# Altium project FIT_TCM.PrjPcb (part 2 of 9)

## Sheet FIT_TCM_Main_PLL.SchDoc: FIT_PM12 board
size 420 x 297 mm; CheckedBy: G.Kasprowicz; Author: INR Moscow; CompanyName: WUT ISE; DrawnBy: M.Podgórski; Organization: WUT ISE; Address1: PW ISE; Address2: Nowowiejska 15/19 00-665 Warsaw; Address3: gkasprow@gmail.com; Revision: 2; SheetNumber: -; SheetTotal: -; ModifiedBy: -; CheckedDate: -; Title2: Title 2; DivGrp: WUT ISE; Designer: INR RAS; ModifiedDate: -; ProjectName: Sensor Box
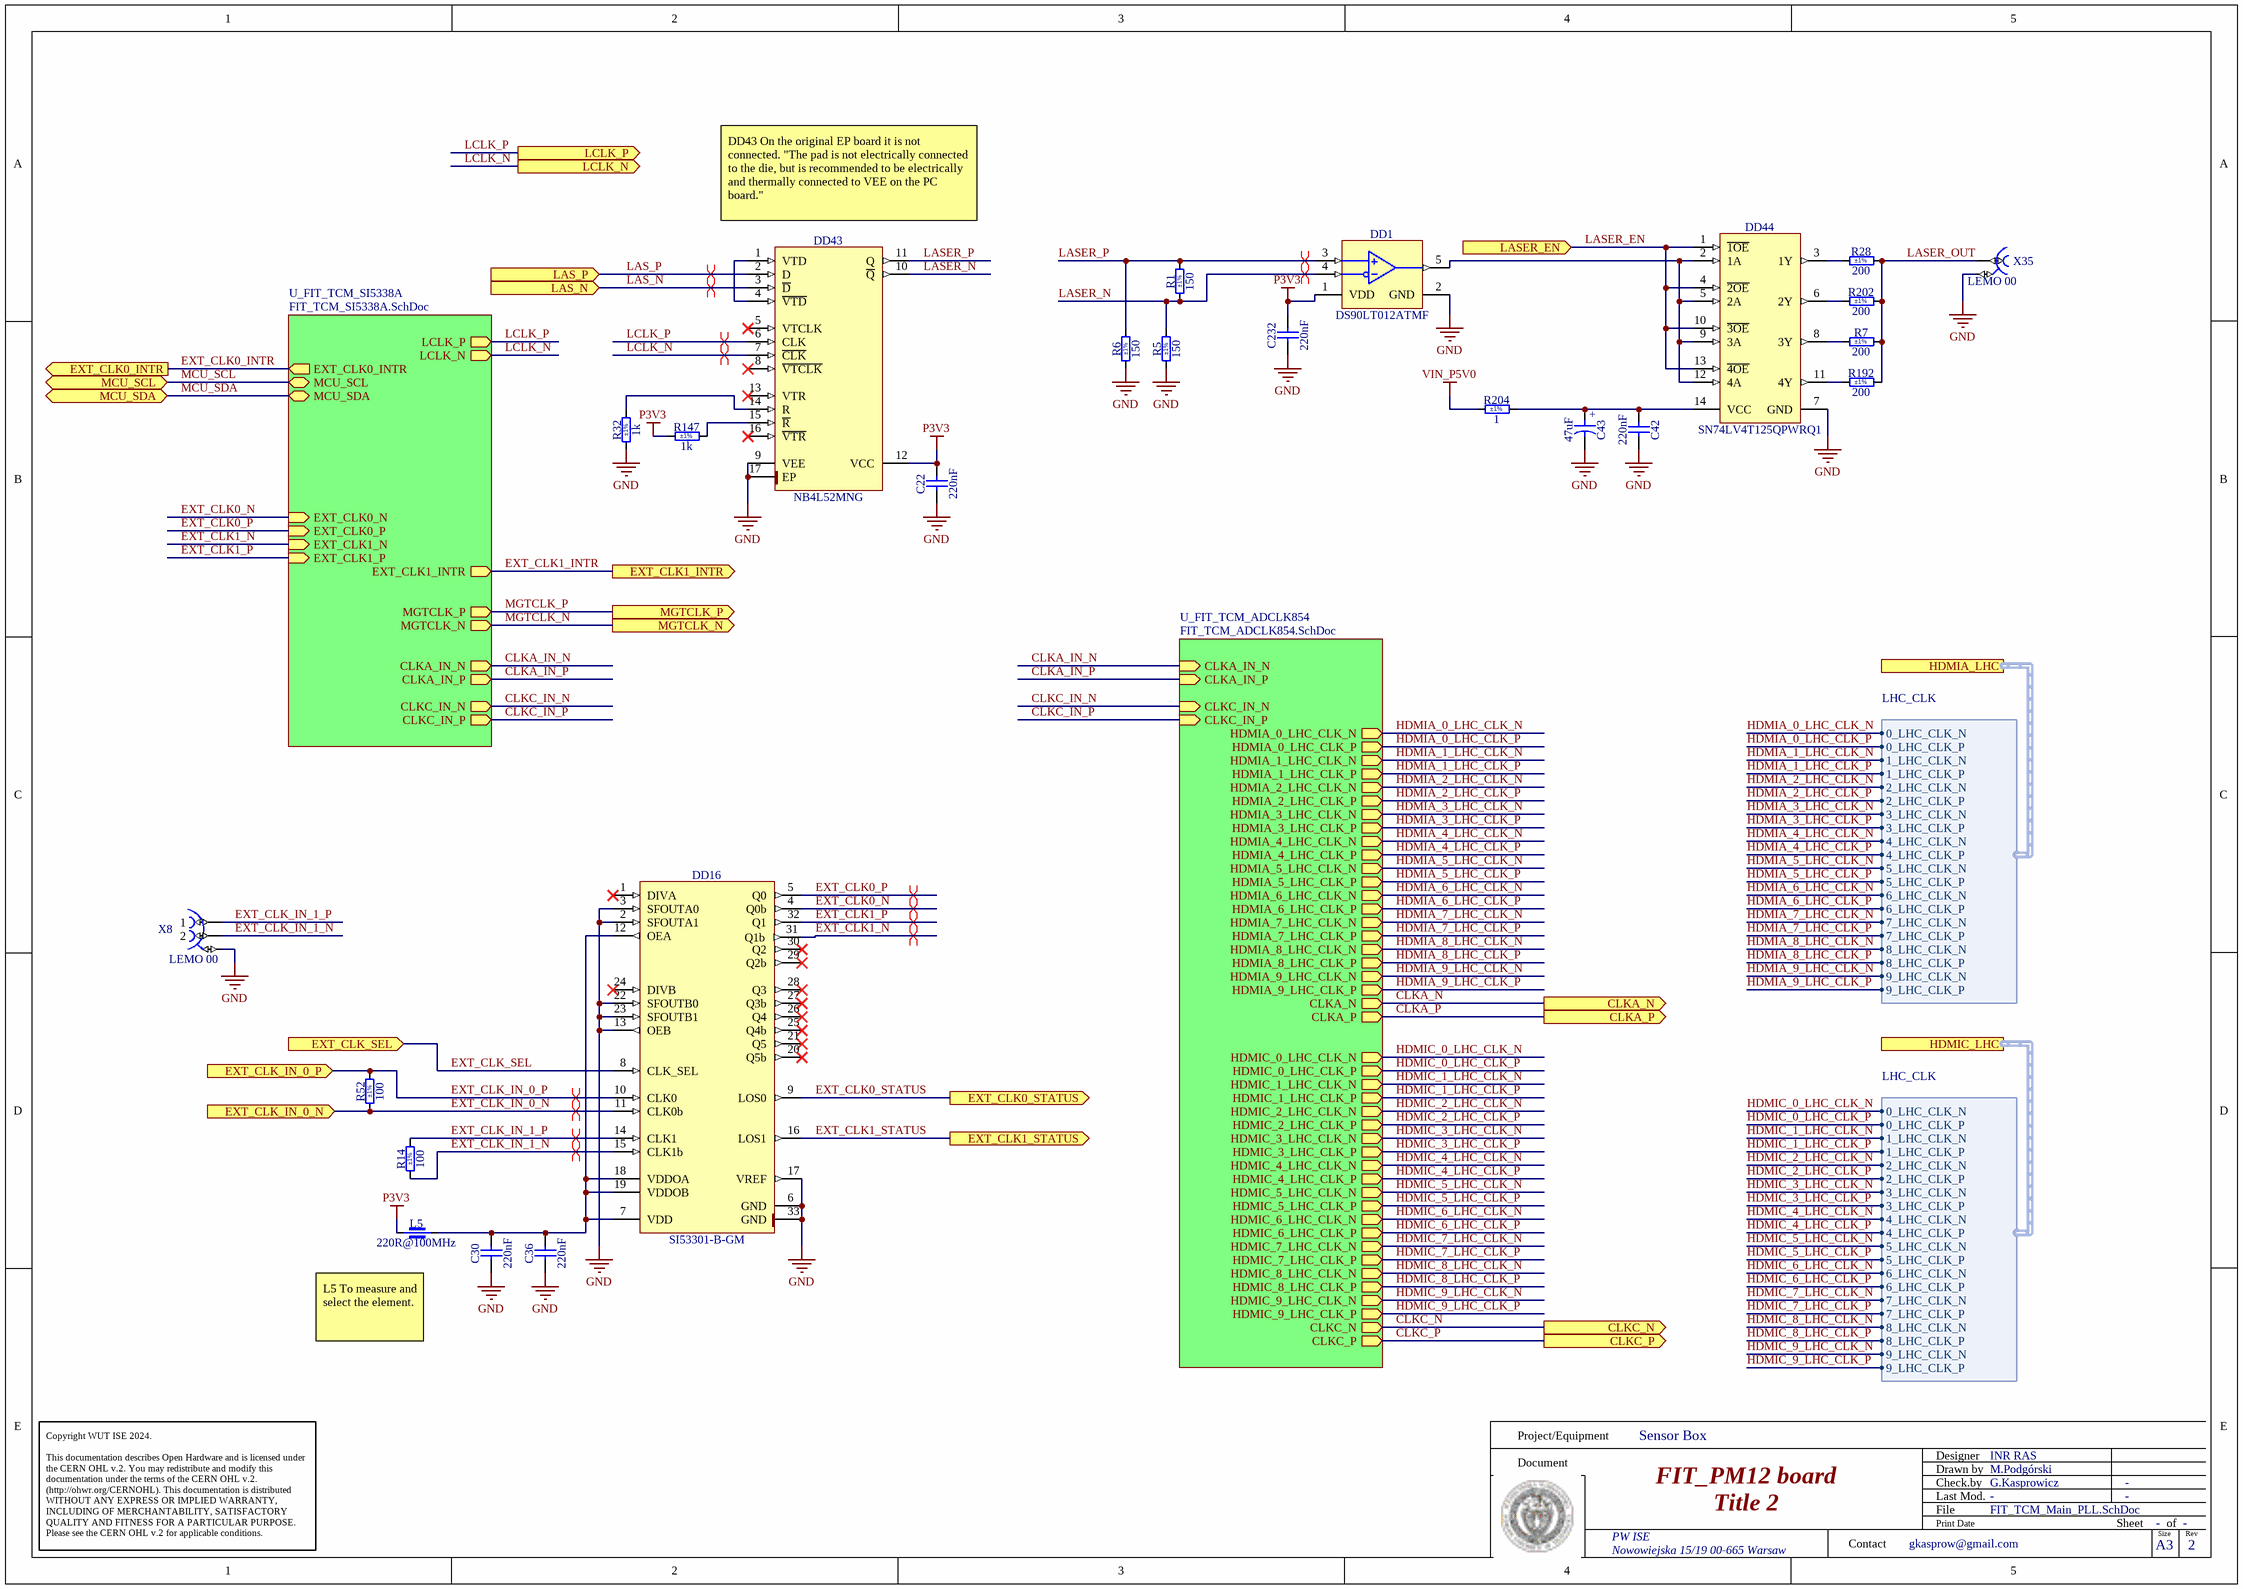
[diagram p2: FIT_TCM_Main_PLL.SchDoc]

### Parts
C22  220nF  [CAPC2012X135N]
C30  220nF  [CAPC2012X135N]
C36  220nF  [CAPC2012X135N]
C42  220nF  [CAPC2012X135N]
C43  47uF  [CAPAE530X610N]
C232  220nF  [CAPC2012X135N]
DD1  DS90LT012ATMF  [SOT95P280X145-5N]
DD16  SI53301-B-GM  [QFN50P500X500X100-33N-S230]
DD43  NB4L52MNG  [QFN50P300X300X100-17N-S185]
DD44  SN74LV4T125QPWRQ1  [SOP65P640X120-14N]
L5  220R@100MHz  [INDC2012X105N]
R1  150  Tolerance: ±1%  [RESC2012X60N]
R5  150  Tolerance: ±1%  [RESC2012X60N]
R6  150  Tolerance: ±1%  [RESC2012X60N]
R7  200  Tolerance: ±1%  [RESC2012X60N]
R14  100  Tolerance: ±1%  [RESC1608X55N]
R28  200  Tolerance: ±1%  [RESC2012X60N]
R32  1k  Tolerance: ±1%  [RESC2012X60N]
R52  100  Tolerance: ±1%  [RESC1608X55N]
R147  1k  Tolerance: ±1%  [RESC2012X60N]
R192  200  Tolerance: ±1%  [RESC2012X60N]
R202  200  Tolerance: ±1%  [RESC2012X60N]
R204  1  Tolerance: ±1%  [RESC2012X60N]
X8  LEMO 00  [LEMO_EPG.00.302.NLN]
X35  LEMO 00  [LEMO_EPL.00.250.NTN]

### Sub-sheets
U_FIT_TCM_ADCLK854 = FIT_TCM_ADCLK854.SchDoc: HDMIA_0_LHC_CLK_P (out), HDMIA_0_LHC_CLK_N (out), HDMIA_1_LHC_CLK_P (out), HDMIA_1_LHC_CLK_N (out), HDMIA_2_LHC_CLK_P (out), HDMIA_2_LHC_CLK_N (out), HDMIA_3_LHC_CLK_P (out), HDMIA_3_LHC_CLK_N (out), HDMIA_4_LHC_CLK_P (out), HDMIA_4_LHC_CLK_N (out), HDMIA_5_LHC_CLK_P (out), HDMIA_5_LHC_CLK_N (out), HDMIA_6_LHC_CLK_P (out), HDMIA_6_LHC_CLK_N (out), HDMIA_7_LHC_CLK_P (out), HDMIA_7_LHC_CLK_N (out), HDMIA_8_LHC_CLK_P (out), HDMIA_8_LHC_CLK_N (out), HDMIA_9_LHC_CLK_P (out), HDMIA_9_LHC_CLK_N (out), CLKA_P (out), CLKA_N (out), CLKA_IN_P (in), CLKA_IN_N (in), HDMIC_0_LHC_CLK_P (out), HDMIC_0_LHC_CLK_N (out), HDMIC_1_LHC_CLK_P (out), HDMIC_1_LHC_CLK_N (out), HDMIC_2_LHC_CLK_P (out), HDMIC_2_LHC_CLK_N (out), HDMIC_3_LHC_CLK_P (out), HDMIC_3_LHC_CLK_N (out), HDMIC_4_LHC_CLK_P (out), HDMIC_4_LHC_CLK_N (out), HDMIC_5_LHC_CLK_P (out), HDMIC_5_LHC_CLK_N (out), HDMIC_6_LHC_CLK_P (out), HDMIC_6_LHC_CLK_N (out), HDMIC_7_LHC_CLK_P (out), HDMIC_7_LHC_CLK_N (out), HDMIC_8_LHC_CLK_P (out), HDMIC_8_LHC_CLK_N (out), HDMIC_9_LHC_CLK_P (out), HDMIC_9_LHC_CLK_N (out), CLKC_P (out), CLKC_N (out), CLKC_IN_P (in), CLKC_IN_N (in)
U_FIT_TCM_SI5338A = FIT_TCM_SI5338A.SchDoc: EXT_CLK0_P (in), EXT_CLK0_N (in), EXT_CLK1_P (in), EXT_CLK1_N (in), MCU_SDA (bidir), MCU_SCL (bidir), EXT_CLK0_INTR (out), EXT_CLK1_INTR (out), LCLK_P (out), LCLK_N (out), CLKA_IN_P (out), CLKA_IN_N (out), CLKC_IN_P (out), CLKC_IN_N (out), MGTCLK_P (out), MGTCLK_N (out)

### Ports
CLKA_N (out), CLKA_P (out), CLKC_N (out), CLKC_P (out), EXT_CLK0_INTR (out), EXT_CLK0_STATUS (out), EXT_CLK1_INTR (out), EXT_CLK1_STATUS (out), EXT_CLK_IN_0_N (in), EXT_CLK_IN_0_P (in), EXT_CLK_SEL (in), HDMIA_LHC (harness LHC_CLK), HDMIC_LHC (harness LHC_CLK), LAS_N (in), LAS_P (in), LASER_EN (in), LCLK_N (out), LCLK_P (out), MCU_SCL (bidir), MCU_SDA (bidir), MGTCLK_N (out), MGTCLK_P (out)

### Harnesses
LHC_CLK: 0_LHC_CLK_N, 0_LHC_CLK_P, 1_LHC_CLK_N, 1_LHC_CLK_P, 2_LHC_CLK_N, 2_LHC_CLK_P, 3_LHC_CLK_N, 4_LHC_CLK_N, 3_LHC_CLK_P, 4_LHC_CLK_P, 5_LHC_CLK_N, 5_LHC_CLK_P, 6_LHC_CLK_N, 6_LHC_CLK_P, 7_LHC_CLK_N, 7_LHC_CLK_P, 8_LHC_CLK_N, 8_LHC_CLK_P, 9_LHC_CLK_N, 9_LHC_CLK_P

### Nets
GND: C22.1 C30.1 C36.1 C42.2 C43.2 C232.1 DD1.2(GND) DD16.2(SFOUTA1) DD16.3(SFOUTA0) DD16.6(GND) DD16.13(OEB) DD16.17(VREF) DD16.22(SFOUTB0) DD16.23(SFOUTB1) DD16.33(GND) DD43.9(VEE) DD43.17(EP) DD44.7(GND) R5.1 R6.1 R32.1 X8.3 X35.2
P3V3: C22.2 C232.2 DD1.1(VDD) DD43.12(VCC) L5.1 R147.1
VIN_P5V0: R204.1
CLKA_IN_N: sheet U_FIT_TCM_ADCLK854/CLKA_IN_N, sheet U_FIT_TCM_SI5338A/CLKA_IN_N
CLKA_IN_P: sheet U_FIT_TCM_ADCLK854/CLKA_IN_P, sheet U_FIT_TCM_SI5338A/CLKA_IN_P
CLKA_N: port CLKA_N, sheet U_FIT_TCM_ADCLK854/CLKA_N
CLKA_P: port CLKA_P, sheet U_FIT_TCM_ADCLK854/CLKA_P
CLKC_IN_N: sheet U_FIT_TCM_ADCLK854/CLKC_IN_N, sheet U_FIT_TCM_SI5338A/CLKC_IN_N
CLKC_IN_P: sheet U_FIT_TCM_ADCLK854/CLKC_IN_P, sheet U_FIT_TCM_SI5338A/CLKC_IN_P
CLKC_N: port CLKC_N, sheet U_FIT_TCM_ADCLK854/CLKC_N
CLKC_P: port CLKC_P, sheet U_FIT_TCM_ADCLK854/CLKC_P
EXT_CLK0_INTR: port EXT_CLK0_INTR, sheet U_FIT_TCM_SI5338A/EXT_CLK0_INTR
EXT_CLK0_N: DD16.4(Q0b) ; sheet U_FIT_TCM_SI5338A/EXT_CLK0_N
EXT_CLK0_P: DD16.5(Q0) ; sheet U_FIT_TCM_SI5338A/EXT_CLK0_P
EXT_CLK0_STATUS: DD16.9(LOS0) ; port EXT_CLK0_STATUS
EXT_CLK1_INTR: port EXT_CLK1_INTR, sheet U_FIT_TCM_SI5338A/EXT_CLK1_INTR
EXT_CLK1_N: DD16.31(Q1b) ; sheet U_FIT_TCM_SI5338A/EXT_CLK1_N
EXT_CLK1_P: DD16.32(Q1) ; sheet U_FIT_TCM_SI5338A/EXT_CLK1_P
EXT_CLK1_STATUS: DD16.16(LOS1) ; port EXT_CLK1_STATUS
EXT_CLK_IN_0_N: DD16.11(CLK0b) R52.1 ; port EXT_CLK_IN_0_N
EXT_CLK_IN_0_P: DD16.10(CLK0) R52.2 ; port EXT_CLK_IN_0_P
EXT_CLK_IN_1_N: DD16.15(CLK1b) R14.1 X8.2
EXT_CLK_IN_1_P: DD16.14(CLK1) R14.2 X8.1
EXT_CLK_SEL: DD16.8(CLK_SEL) ; port EXT_CLK_SEL
HDMIA_0_LHC_CLK_N: sheet U_FIT_TCM_ADCLK854/HDMIA_0_LHC_CLK_N, port HDMIA_LHC.0_LHC_CLK_N  [project net HDMIA_LHC.0_LHC_CLK_N]
HDMIA_0_LHC_CLK_P: sheet U_FIT_TCM_ADCLK854/HDMIA_0_LHC_CLK_P, port HDMIA_LHC.0_LHC_CLK_P  [project net HDMIA_LHC.0_LHC_CLK_P]
HDMIA_1_LHC_CLK_N: sheet U_FIT_TCM_ADCLK854/HDMIA_1_LHC_CLK_N, port HDMIA_LHC.1_LHC_CLK_N  [project net HDMIA_LHC.1_LHC_CLK_N]
HDMIA_1_LHC_CLK_P: sheet U_FIT_TCM_ADCLK854/HDMIA_1_LHC_CLK_P, port HDMIA_LHC.1_LHC_CLK_P  [project net HDMIA_LHC.1_LHC_CLK_P]
HDMIA_2_LHC_CLK_N: sheet U_FIT_TCM_ADCLK854/HDMIA_2_LHC_CLK_N, port HDMIA_LHC.2_LHC_CLK_N  [project net HDMIA_LHC.2_LHC_CLK_N]
HDMIA_2_LHC_CLK_P: sheet U_FIT_TCM_ADCLK854/HDMIA_2_LHC_CLK_P, port HDMIA_LHC.2_LHC_CLK_P  [project net HDMIA_LHC.2_LHC_CLK_P]
HDMIA_3_LHC_CLK_N: sheet U_FIT_TCM_ADCLK854/HDMIA_3_LHC_CLK_N, port HDMIA_LHC.3_LHC_CLK_N  [project net HDMIA_LHC.3_LHC_CLK_N]
HDMIA_3_LHC_CLK_P: sheet U_FIT_TCM_ADCLK854/HDMIA_3_LHC_CLK_P, port HDMIA_LHC.3_LHC_CLK_P  [project net HDMIA_LHC.3_LHC_CLK_P]
HDMIA_4_LHC_CLK_N: sheet U_FIT_TCM_ADCLK854/HDMIA_4_LHC_CLK_N, port HDMIA_LHC.4_LHC_CLK_N  [project net HDMIA_LHC.4_LHC_CLK_N]
HDMIA_4_LHC_CLK_P: sheet U_FIT_TCM_ADCLK854/HDMIA_4_LHC_CLK_P, port HDMIA_LHC.4_LHC_CLK_P  [project net HDMIA_LHC.4_LHC_CLK_P]
HDMIA_5_LHC_CLK_N: sheet U_FIT_TCM_ADCLK854/HDMIA_5_LHC_CLK_N, port HDMIA_LHC.5_LHC_CLK_N  [project net HDMIA_LHC.5_LHC_CLK_N]
HDMIA_5_LHC_CLK_P: sheet U_FIT_TCM_ADCLK854/HDMIA_5_LHC_CLK_P, port HDMIA_LHC.5_LHC_CLK_P  [project net HDMIA_LHC.5_LHC_CLK_P]
HDMIA_6_LHC_CLK_N: sheet U_FIT_TCM_ADCLK854/HDMIA_6_LHC_CLK_N, port HDMIA_LHC.6_LHC_CLK_N  [project net HDMIA_LHC.6_LHC_CLK_N]
HDMIA_6_LHC_CLK_P: sheet U_FIT_TCM_ADCLK854/HDMIA_6_LHC_CLK_P, port HDMIA_LHC.6_LHC_CLK_P  [project net HDMIA_LHC.6_LHC_CLK_P]
HDMIA_7_LHC_CLK_N: sheet U_FIT_TCM_ADCLK854/HDMIA_7_LHC_CLK_N, port HDMIA_LHC.7_LHC_CLK_N  [project net HDMIA_LHC.7_LHC_CLK_N]
HDMIA_7_LHC_CLK_P: sheet U_FIT_TCM_ADCLK854/HDMIA_7_LHC_CLK_P, port HDMIA_LHC.7_LHC_CLK_P  [project net HDMIA_LHC.7_LHC_CLK_P]
HDMIA_8_LHC_CLK_N: sheet U_FIT_TCM_ADCLK854/HDMIA_8_LHC_CLK_N, port HDMIA_LHC.8_LHC_CLK_N  [project net HDMIA_LHC.8_LHC_CLK_N]
HDMIA_8_LHC_CLK_P: sheet U_FIT_TCM_ADCLK854/HDMIA_8_LHC_CLK_P, port HDMIA_LHC.8_LHC_CLK_P  [project net HDMIA_LHC.8_LHC_CLK_P]
HDMIA_9_LHC_CLK_N: sheet U_FIT_TCM_ADCLK854/HDMIA_9_LHC_CLK_N, port HDMIA_LHC.9_LHC_CLK_N  [project net HDMIA_LHC.9_LHC_CLK_N]
HDMIA_9_LHC_CLK_P: sheet U_FIT_TCM_ADCLK854/HDMIA_9_LHC_CLK_P, port HDMIA_LHC.9_LHC_CLK_P  [project net HDMIA_LHC.9_LHC_CLK_P]
HDMIC_0_LHC_CLK_N: sheet U_FIT_TCM_ADCLK854/HDMIC_0_LHC_CLK_N, port HDMIC_LHC.0_LHC_CLK_N  [project net HDMIC_LHC.0_LHC_CLK_N]
HDMIC_0_LHC_CLK_P: sheet U_FIT_TCM_ADCLK854/HDMIC_0_LHC_CLK_P, port HDMIC_LHC.0_LHC_CLK_P  [project net HDMIC_LHC.0_LHC_CLK_P]
HDMIC_1_LHC_CLK_N: sheet U_FIT_TCM_ADCLK854/HDMIC_1_LHC_CLK_N, port HDMIC_LHC.1_LHC_CLK_N  [project net HDMIC_LHC.1_LHC_CLK_N]
HDMIC_1_LHC_CLK_P: sheet U_FIT_TCM_ADCLK854/HDMIC_1_LHC_CLK_P, port HDMIC_LHC.1_LHC_CLK_P  [project net HDMIC_LHC.1_LHC_CLK_P]
HDMIC_2_LHC_CLK_N: sheet U_FIT_TCM_ADCLK854/HDMIC_2_LHC_CLK_N, port HDMIC_LHC.2_LHC_CLK_N  [project net HDMIC_LHC.2_LHC_CLK_N]
HDMIC_2_LHC_CLK_P: sheet U_FIT_TCM_ADCLK854/HDMIC_2_LHC_CLK_P, port HDMIC_LHC.2_LHC_CLK_P  [project net HDMIC_LHC.2_LHC_CLK_P]
HDMIC_3_LHC_CLK_N: sheet U_FIT_TCM_ADCLK854/HDMIC_3_LHC_CLK_N, port HDMIC_LHC.3_LHC_CLK_N  [project net HDMIC_LHC.3_LHC_CLK_N]
HDMIC_3_LHC_CLK_P: sheet U_FIT_TCM_ADCLK854/HDMIC_3_LHC_CLK_P, port HDMIC_LHC.3_LHC_CLK_P  [project net HDMIC_LHC.3_LHC_CLK_P]
HDMIC_4_LHC_CLK_N: sheet U_FIT_TCM_ADCLK854/HDMIC_4_LHC_CLK_N, port HDMIC_LHC.4_LHC_CLK_N  [project net HDMIC_LHC.4_LHC_CLK_N]
HDMIC_4_LHC_CLK_P: sheet U_FIT_TCM_ADCLK854/HDMIC_4_LHC_CLK_P, port HDMIC_LHC.4_LHC_CLK_P  [project net HDMIC_LHC.4_LHC_CLK_P]
HDMIC_5_LHC_CLK_N: sheet U_FIT_TCM_ADCLK854/HDMIC_5_LHC_CLK_N, port HDMIC_LHC.5_LHC_CLK_N  [project net HDMIC_LHC.5_LHC_CLK_N]
HDMIC_5_LHC_CLK_P: sheet U_FIT_TCM_ADCLK854/HDMIC_5_LHC_CLK_P, port HDMIC_LHC.5_LHC_CLK_P  [project net HDMIC_LHC.5_LHC_CLK_P]
HDMIC_6_LHC_CLK_N: sheet U_FIT_TCM_ADCLK854/HDMIC_6_LHC_CLK_N, port HDMIC_LHC.6_LHC_CLK_N  [project net HDMIC_LHC.6_LHC_CLK_N]
HDMIC_6_LHC_CLK_P: sheet U_FIT_TCM_ADCLK854/HDMIC_6_LHC_CLK_P, port HDMIC_LHC.6_LHC_CLK_P  [project net HDMIC_LHC.6_LHC_CLK_P]
HDMIC_7_LHC_CLK_N: sheet U_FIT_TCM_ADCLK854/HDMIC_7_LHC_CLK_N, port HDMIC_LHC.7_LHC_CLK_N  [project net HDMIC_LHC.7_LHC_CLK_N]
HDMIC_7_LHC_CLK_P: sheet U_FIT_TCM_ADCLK854/HDMIC_7_LHC_CLK_P, port HDMIC_LHC.7_LHC_CLK_P  [project net HDMIC_LHC.7_LHC_CLK_P]
HDMIC_8_LHC_CLK_N: sheet U_FIT_TCM_ADCLK854/HDMIC_8_LHC_CLK_N, port HDMIC_LHC.8_LHC_CLK_N  [project net HDMIC_LHC.8_LHC_CLK_N]
HDMIC_8_LHC_CLK_P: sheet U_FIT_TCM_ADCLK854/HDMIC_8_LHC_CLK_P, port HDMIC_LHC.8_LHC_CLK_P  [project net HDMIC_LHC.8_LHC_CLK_P]
HDMIC_9_LHC_CLK_N: sheet U_FIT_TCM_ADCLK854/HDMIC_9_LHC_CLK_N, port HDMIC_LHC.9_LHC_CLK_N  [project net HDMIC_LHC.9_LHC_CLK_N]
HDMIC_9_LHC_CLK_P: sheet U_FIT_TCM_ADCLK854/HDMIC_9_LHC_CLK_P, port HDMIC_LHC.9_LHC_CLK_P  [project net HDMIC_LHC.9_LHC_CLK_P]
LAS_N: DD43.3(~{D}) ; port LAS_N
LAS_P: DD43.2(D) ; port LAS_P
LASER_EN: DD44.1(~{1OE}) DD44.4(~{2OE}) DD44.10(~{3OE}) DD44.13(~{4OE}) ; port LASER_EN
LASER_N: DD1.4(IN-) DD43.10(~{Q}) R1.1 R5.2
LASER_OUT: R7.2 R28.2 R192.2 R202.2 X35.1
LASER_P: DD1.3(IN+) DD43.11(Q) R1.2 R6.2
LCLK_N: DD43.7(~{CLK}) ; port LCLK_N, sheet U_FIT_TCM_SI5338A/LCLK_N
LCLK_P: DD43.6(CLK) ; port LCLK_P, sheet U_FIT_TCM_SI5338A/LCLK_P
MCU_SCL: port MCU_SCL, sheet U_FIT_TCM_SI5338A/MCU_SCL
MCU_SDA: port MCU_SDA, sheet U_FIT_TCM_SI5338A/MCU_SDA
MGTCLK_N: port MGTCLK_N, sheet U_FIT_TCM_SI5338A/MGTCLK_N
MGTCLK_P: port MGTCLK_P, sheet U_FIT_TCM_SI5338A/MGTCLK_P
NetC30_2: C30.2 C36.2 DD16.7(VDD) DD16.12(OEA) DD16.18(VDDOA) DD16.19(VDDOB) L5.2
NetC42_1: C42.1 C43.1 DD44.14(VCC) R204.2
NetDD1_5: DD1.5(TTLOUT) DD44.2(1A) DD44.5(2A) DD44.9(3A) DD44.12(4A)
NetDD43_1: DD43.1(VTD) DD43.4(~{VTD})
NetDD43_14: DD43.14(R) R32.2
NetDD43_15: DD43.15(~{R}) R147.2
NetDD44_3: DD44.3(1Y) R28.1
NetDD44_6: DD44.6(2Y) R202.1
NetDD44_8: DD44.8(3Y) R7.1
NetDD44_11: DD44.11(4Y) R192.1

Not connected (* = marked no-connect by the designer): DD16 1(DIVA)* 20(Q5b)* 21(Q5)* 24(DIVB)* 25(Q4b)* 26(Q4)* 27(Q3b)* 28(Q3)* 29(Q2b)* 30(Q2)*; DD43 5(VTCLK)* 8(~{VTCLK})* 13(VTR)* 16(~{VTR})*

### Layout directives
differential pair: EXT_CLK0_N, EXT_CLK0_P, EXT_CLK1_N, EXT_CLK1_P, EXT_CLK_IN_0_N, EXT_CLK_IN_0_P, EXT_CLK_IN_1_N, EXT_CLK_IN_1_P, LAS_N, LAS_P, LASER_N, LASER_P, LCLK_N, LCLK_P

### Notes on the sheet
- (near DD43) DD43 On the original EP board it is not connected. "The pad is not electrically connected to the die, but is recommended to be electrically and thermally connected to VEE on the PC board."
- (near L5) L5 To measure and select the element.
- Project/Equipment
- Document
- Designer
- Drawn by
- Check.by
- Copyright WUT ISE 2024.
  This documentation describes Open Hardware and is licensed under the CERN OHL v.2. You may redistribute and modify this documentation under the terms of the CERN OHL v.2. (http://ohwr.org/CERNOHL). This documentation is distributed WITHOUT ANY EXPRESS OR IMPLIED WARRANTY, INCLUDING OF MERCHANTABILITY, SATISFACTORY QUALITY AND FITNESS FOR A PARTICULAR PURPOSE. Please see the CERN OHL v.2 for applicable conditions.
- Contact
- File
- Last Mod.
- Print Date
- Sheet
- Size
- A3
- of
- Rev
- (in symbol CAE530-610_47UF_16V_20%) +

### Library data of the parts
C22 C30 C36 C42 C232 = CC0805_220NF_50V_10%_X7R: as C71 on sheet FIT_TCM_ATxmega; Part Number: CC0805_220NF_50V_10%_X7R; Component Kind: Standard; Component Type: Standard; Pin Count: 2; Value: 220nF; Status: Preferred; Manufacturer Part Number: CC0805_220NF_50V_10%_X7R; Case: 0805; Mounted: Yes; Socket: No; SMD: Yes; Sense: No; Manufacturer1 Example: MURATA; Manufacturer1 ComponentHeight: 1.35mm; HelpURL: \\cern.ch\dfs\Applications\Altium\Datasheets\CC0805_X7R_MURATA.pdf; Author: CERN DEM JLC; CreateDate: 03.12.2007; LatestRevisionDate: 03.12.2007
C43 = CAE530-610_47UF_16V_20%: Polarised capacitor; Part Description: Conductive Polymer Hybrid Aluminum Electrolytic Capacitor; Manufacturer: CHEMI-CON; Manufacturer Part Number: HHXD160ARA470ME61G; Voltage: 16V; Tolerance: ±20%; Part Number: CAE530-610_47UF_16V_20%; Component Kind: Standard; Component Type: Standard; Pin Count: 2; Value: 47uF; Status: Not Recommended; Case: C; Mounted: Yes; Socket: No; SMD: Yes; Sense: No; ComponentHeight: 6.1mm; HelpURL: \\cern.ch\dfs\Applications\Altium\Datasheets\CAE_CHIMI-CON_HXD.pdf; Author: CERN DEM HF; CreateDate: 15.04.2024; LatestRevisionDate: 15.04.2024
DD1 = DS90LT012ATMF: 3V LVDS Single CMOS Differential Line Receiver; Manufacturer: TEXAS INSTRUMENTS; PressFit: No; Bonding: No; Part Number: DS90LT012ATMF; Component Kind: Standard; Component Type: Standard; Device: DS90LT012ATMF; PackageDescription: SOT, 0.95mm Pitch; 5 Pin, 1.60mm W X 2.90mm L X 1.45mm H body, IPC Medium Density; Part Description: 3V LVDS Single CMOS Differential Line Receiver; Manufacturer Part Number: DS90LT012ATMF; Pin Count: 5; Case: SOT23-5; Mounted: Yes; Socket: No; SMD: Yes; Sense: No; ComponentHeight: 1.45mm; Author: CERN DEM HF; HelpURL: \\cern.ch\dfs\Applications\Altium\Datasheets\DS90LT012ATMF.pdf; CreateDate: 08.05.2024; LatestRevisionDate: 08.05.2024
DD16 = SI53301-B-GM: I2C-Programmable Any-Frequency, Any-Output Quad Clock Generator; Part Description: Ultra-Low Additive Jitter Fanout Clock Buffers with up to 10 Universal Outputs from Any-Format Input and Wide Frequency Range from 1 MHz to 725 MHz; Manufacturer: SKYWORKS; PressFit: No; Bonding: No; Part Number: SI53301-B-GM; Component Kind: Standard; Component Type: Standard; Device: SI53301-B-GM; PackageDescription: QFN, 0.50mm Pitch, Square; 32 Pin, 5.00mm L X 5.00mm W X 1mm H body (w/Thermal Tab 2.3 X 2.3mm), IPC Medium Density; Manufacturer Part Number: SI53301-B-GM; Pin Count: 33; Case: QFN32; Mounted: Yes; Socket: No; SMD: Yes; Sense: No; ComponentHeight: 1mm; HelpURL: \\cern.ch\dfs\Applications\Altium\Datasheets\SI53301.pdf; Author: CERN DEM HF; CreateDate: 09.05.2023; LatestRevisionDate: 09.05.2023
DD43 = NB4L52MNG: 2.5 V/3.3 V/5.0 V Differential Data/Clock D Flip-Flop with Reset; Manufacturer: ON SEMICONDUCTOR; PressFit: No; Bonding: No; Part Number: NB4L52MNG; Component Kind: Standard; Component Type: Standard; Device: NB4L52MNG; PackageDescription: QFN, 0.50mm Pitch, Square; 16 Pin, 3.00mm L X 3.00mm W X 1.00mm H body (w/Thermal Tab 1.85 X 1.85mm), IPC Medium Density; Part Description: 2.5 V/3.3 V/5.0 V Differential Data/Clock D Flip-Flop with Reset; Manufacturer Part Number: NB4L52MN; Pin Count: 16; Case: QFN16; Mounted: Yes; Socket: No; SMD: Yes; Sense: No; ComponentHeight: 1mm; Author: CERN DEM MR; HelpURL: \\cern.ch\dfs\Applications\Altium\Datasheets\NB4L52MNG.pdf; CreateDate: 15.01.2016; LatestRevisionDate: 04.04.2022
DD44 = SN74LV4T125QPWRQ1: Quadruple Buffer Translator With 3-State Outputs; Manufacturer: TEXAS INSTRUMENTS; PressFit: No; Bonding: No; Part Number: SN74LV4T125QPWRQ1; Component Kind: Standard; Component Type: Standard; Device: SN74LV4T125QPWRQ1; PackageDescription: SOP, 0.65mm Pitch; 14 Pin, 4.40mm W X 5.00mm L X 1.20mm H body, IPC Medium Density; Part Description: Quadruple Buffer Translator With 3-State Outputs; Manufacturer Part Number: SN74LV4T125QPWRQ1; Pin Count: 14; Case: TSSOP14; Mounted: Yes; Socket: No; SMD: Yes; Sense: No; ComponentHeight: 1.2mm; Author: CERN DEM HF; HelpURL: \\cern.ch\dfs\Applications\Altium\Datasheets\SN74LV4T125-Q1.pdf; CreateDate: 12.06.2024; LatestRevisionDate: 12.06.2024
L5 = IND0805_TDK_MPZ2012S221A: Part Description: SMT Chip Bead for General Power Line (MPZ Series); Manufacturer: TDK; Power: 3A; Resistance: 0.04R; Tolerance: ±25%; Part Number: IND0805_TDK_MPZ2012S221A; Component Kind: Standard; Component Type: Standard; Pin Count: 2; Value: 220R@100MHz; Manufacturer Part Number: MPZ2012S221A; Case: 0805; Mounted: Yes; Socket: No; SMD: Yes; Sense: No; ComponentHeight: 1.05mm; HelpURL: \\cern.ch\dfs\Applications\Altium\Datasheets\IND0805_TDK_MPZ2012.pdf; Author: CERN DEM HF; CreateDate: 04.10.2021; LatestRevisionDate: 04.10.2021
R1 R5 R6 = R0805_150R_1%_0.125W_100PPM: Resistor - 1%; Part Description: General Purpose Thick Film Chip Resistor; Manufacturer: GENERIC; Manufacturer1 Part Number: NRC10F1500TRF; Power: 0.125W; TC: ±100ppm/°C; PressFit: No; Part Number: R0805_150R_1%_0.125W_100PPM; Component Kind: Standard; Component Type: Standard; Pin Count: 2; Value: 150; Status: Preferred; Manufacturer Part Number: R0805_150R_1%_0.125W_100PPM; Case: 0805; Mounted: Yes; Sense: No; Socket: No; SMD: Yes; Manufacturer1 Example: NIC COMPONENT; Manufacturer1 ComponentHeight: 0.6mm; HelpURL: \\cern.ch\dfs\Applications\Altium\Datasheets\R0805_NIC_NRC.pdf; Author: CERN DEM JLC; CreateDate: 03.12.2007; LatestRevisionDate: 13.03.2008
R7 R28 R192 R202 = R0805_200R_1%_0.125W_100PPM: Resistor - 1%; Part Description: General Purpose Thick Film Chip Resistor; Manufacturer: GENERIC; Manufacturer1 Part Number: NRC10F2000TRF; Power: 0.125W; TC: ±100ppm/°C; PressFit: No; Part Number: R0805_200R_1%_0.125W_100PPM; Component Kind: Standard; Component Type: Standard; Pin Count: 2; Value: 200; Status: Preferred; Manufacturer Part Number: R0805_200R_1%_0.125W_100PPM; Case: 0805; Mounted: Yes; Sense: No; Socket: No; SMD: Yes; Manufacturer1 Example: NIC COMPONENT; Manufacturer1 ComponentHeight: 0.6mm; HelpURL: \\cern.ch\dfs\Applications\Altium\Datasheets\R0805_NIC_NRC.pdf; Author: CERN DEM JLC; CreateDate: 03.12.2007; LatestRevisionDate: 13.03.2008
R14 R52 = R0603_100R_1%_0.1W_100PPM: Resistor - 1%; Part Description: General Purpose Thick Film Chip Resistor; Manufacturer: GENERIC; Manufacturer1 Part Number: NRC06F4700TRF; Power: 0.1W; TC: ±100ppm/°C; PressFit: No; Part Number: R0603_100R_1%_0.1W_100PPM; Component Kind: Standard; Component Type: Standard; Pin Count: 2; Value: 100; Status: Preferred; Manufacturer Part Number: R0603_100R_1%_0.1W_100PPM; Case: 0603; Mounted: Yes; Sense: No; Socket: No; SMD: Yes; Manufacturer1 Example: NIC COMPONENT; Manufacturer1 ComponentHeight: 0.55mm; HelpURL: \\cern.ch\dfs\Applications\Altium\Datasheets\R0603_NIC_NRC.pdf; Author: CERN DEM JLC; CreateDate: 03.12.2007; LatestRevisionDate: 13.03.2008
R32 R147 = R0805_1K_1%_0.125W_100PPM: Resistor - 1%; Part Description: General Purpose Thick Film Chip Resistor; Manufacturer: GENERIC; Manufacturer1 Part Number: NRC10F1001TRF; Power: 0.125W; TC: ±100ppm/°C; PressFit: No; Part Number: R0805_1K_1%_0.125W_100PPM; Component Kind: Standard; Component Type: Standard; Pin Count: 2; Value: 1k; Status: Preferred; Manufacturer Part Number: R0805_1K_1%_0.125W_100PPM; Case: 0805; Mounted: Yes; Sense: No; Socket: No; SMD: Yes; Manufacturer1 Example: NIC COMPONENT; Manufacturer1 ComponentHeight: 0.6mm; HelpURL: \\cern.ch\dfs\Applications\Altium\Datasheets\R0805_NIC_NRC.pdf; Author: CERN DEM JLC; CreateDate: 03.12.2007; LatestRevisionDate: 13.03.2008
R204 = R0805_1R_1%_0.125W_100PPM: Resistor - 1%; Part Description: Thick Film Chip Resistor; Manufacturer: GENERIC; Manufacturer1 Part Number: CRCW08051R00FKEA; Power: 0.125W; TC: ±100ppm/°C; PressFit: No; Part Number: R0805_1R_1%_0.125W_100PPM; Component Kind: Standard; Component Type: Standard; Pin Count: 2; Value: 1; Status: None; Manufacturer Part Number: R0805_1R_1%_0.125W_100PPM; Case: 0805; Mounted: Yes; Sense: No; Socket: No; SMD: Yes; Manufacturer1 Example: VISHAY; Manufacturer1 ComponentHeight: 0.6mm; HelpURL: \\cern.ch\dfs\Applications\Altium\Datasheets\R0805_VISHAY_CRCW e3.pdf; Author: CERN DEM HF; CreateDate: 07.06.2024; LatestRevisionDate: 07.06.2024
X8 = LEMO_EPG.00.302.NLN: Part Description: Size 00, Elbow Socket (90°) with 2 Female Contacts and Alignment Key (G); PressFit: No; SCEM: 09.31.28.007.2; Part Number: LEMO_EPG.00.302.NLN; Component Kind: Standard; Component Type: Standard; Pin Count: 3; Family: LEMO 00; Mounted: Yes; Socket: No; SMD: No; Sense: No; Status: None; Manufacturer: LEMO; Manufacturer Part Number: EPG.00.302.NLN; ComponentHeight: 7mm; HelpURL: \\cern.ch\dfs\Applications\Altium\Datasheets\LEMO_EPG.00.302.NLN.pdf; Author: CERN DEM JLC; CreateDate: 25.08.2010; LatestRevisionDate: 20.12.2010
X35 = LEMO_EPL.00.250.NTN: Part Description: Size 00, 50 Ohms Coaxial Elbow (90°) socket; PressFit: No; Part Number: LEMO_EPL.00.250.NTN; Component Kind: Standard; Component Type: Standard; Pin Count: 2; Family: LEMO 00; Mounted: Yes; Socket: No; SMD: No; Sense: No; Status: Obsolete; Manufacturer: LEMO; Manufacturer Part Number: EPL.00.250.NTN; ComponentHeight: 7mm; HelpURL: \\cern.ch\dfs\Applications\Altium\Datasheets\LEMO_EPL.00.250.NTN.pdf; Author: CERN DEM JLC; CreateDate: 03.12.2007; LatestRevisionDate: 11.02.2016

## Sheet FIT_TCM_ADCLK854.SchDoc: FIT_PM12 board
size 420 x 297 mm; CheckedBy: G.Kasprowicz; Author: INR Moscow; CompanyName: WUT ISE; DrawnBy: M.Podgórski; Organization: WUT ISE; Address1: PW ISE; Address2: Nowowiejska 15/19 00-665 Warsaw; Address3: gkasprow@gmail.com; Revision: 2; SheetNumber: -; SheetTotal: -; ModifiedBy: -; CheckedDate: -; Title2: Title 2; DivGrp: WUT ISE; Designer: INR RAS; ModifiedDate: -; ProjectName: Sensor Box
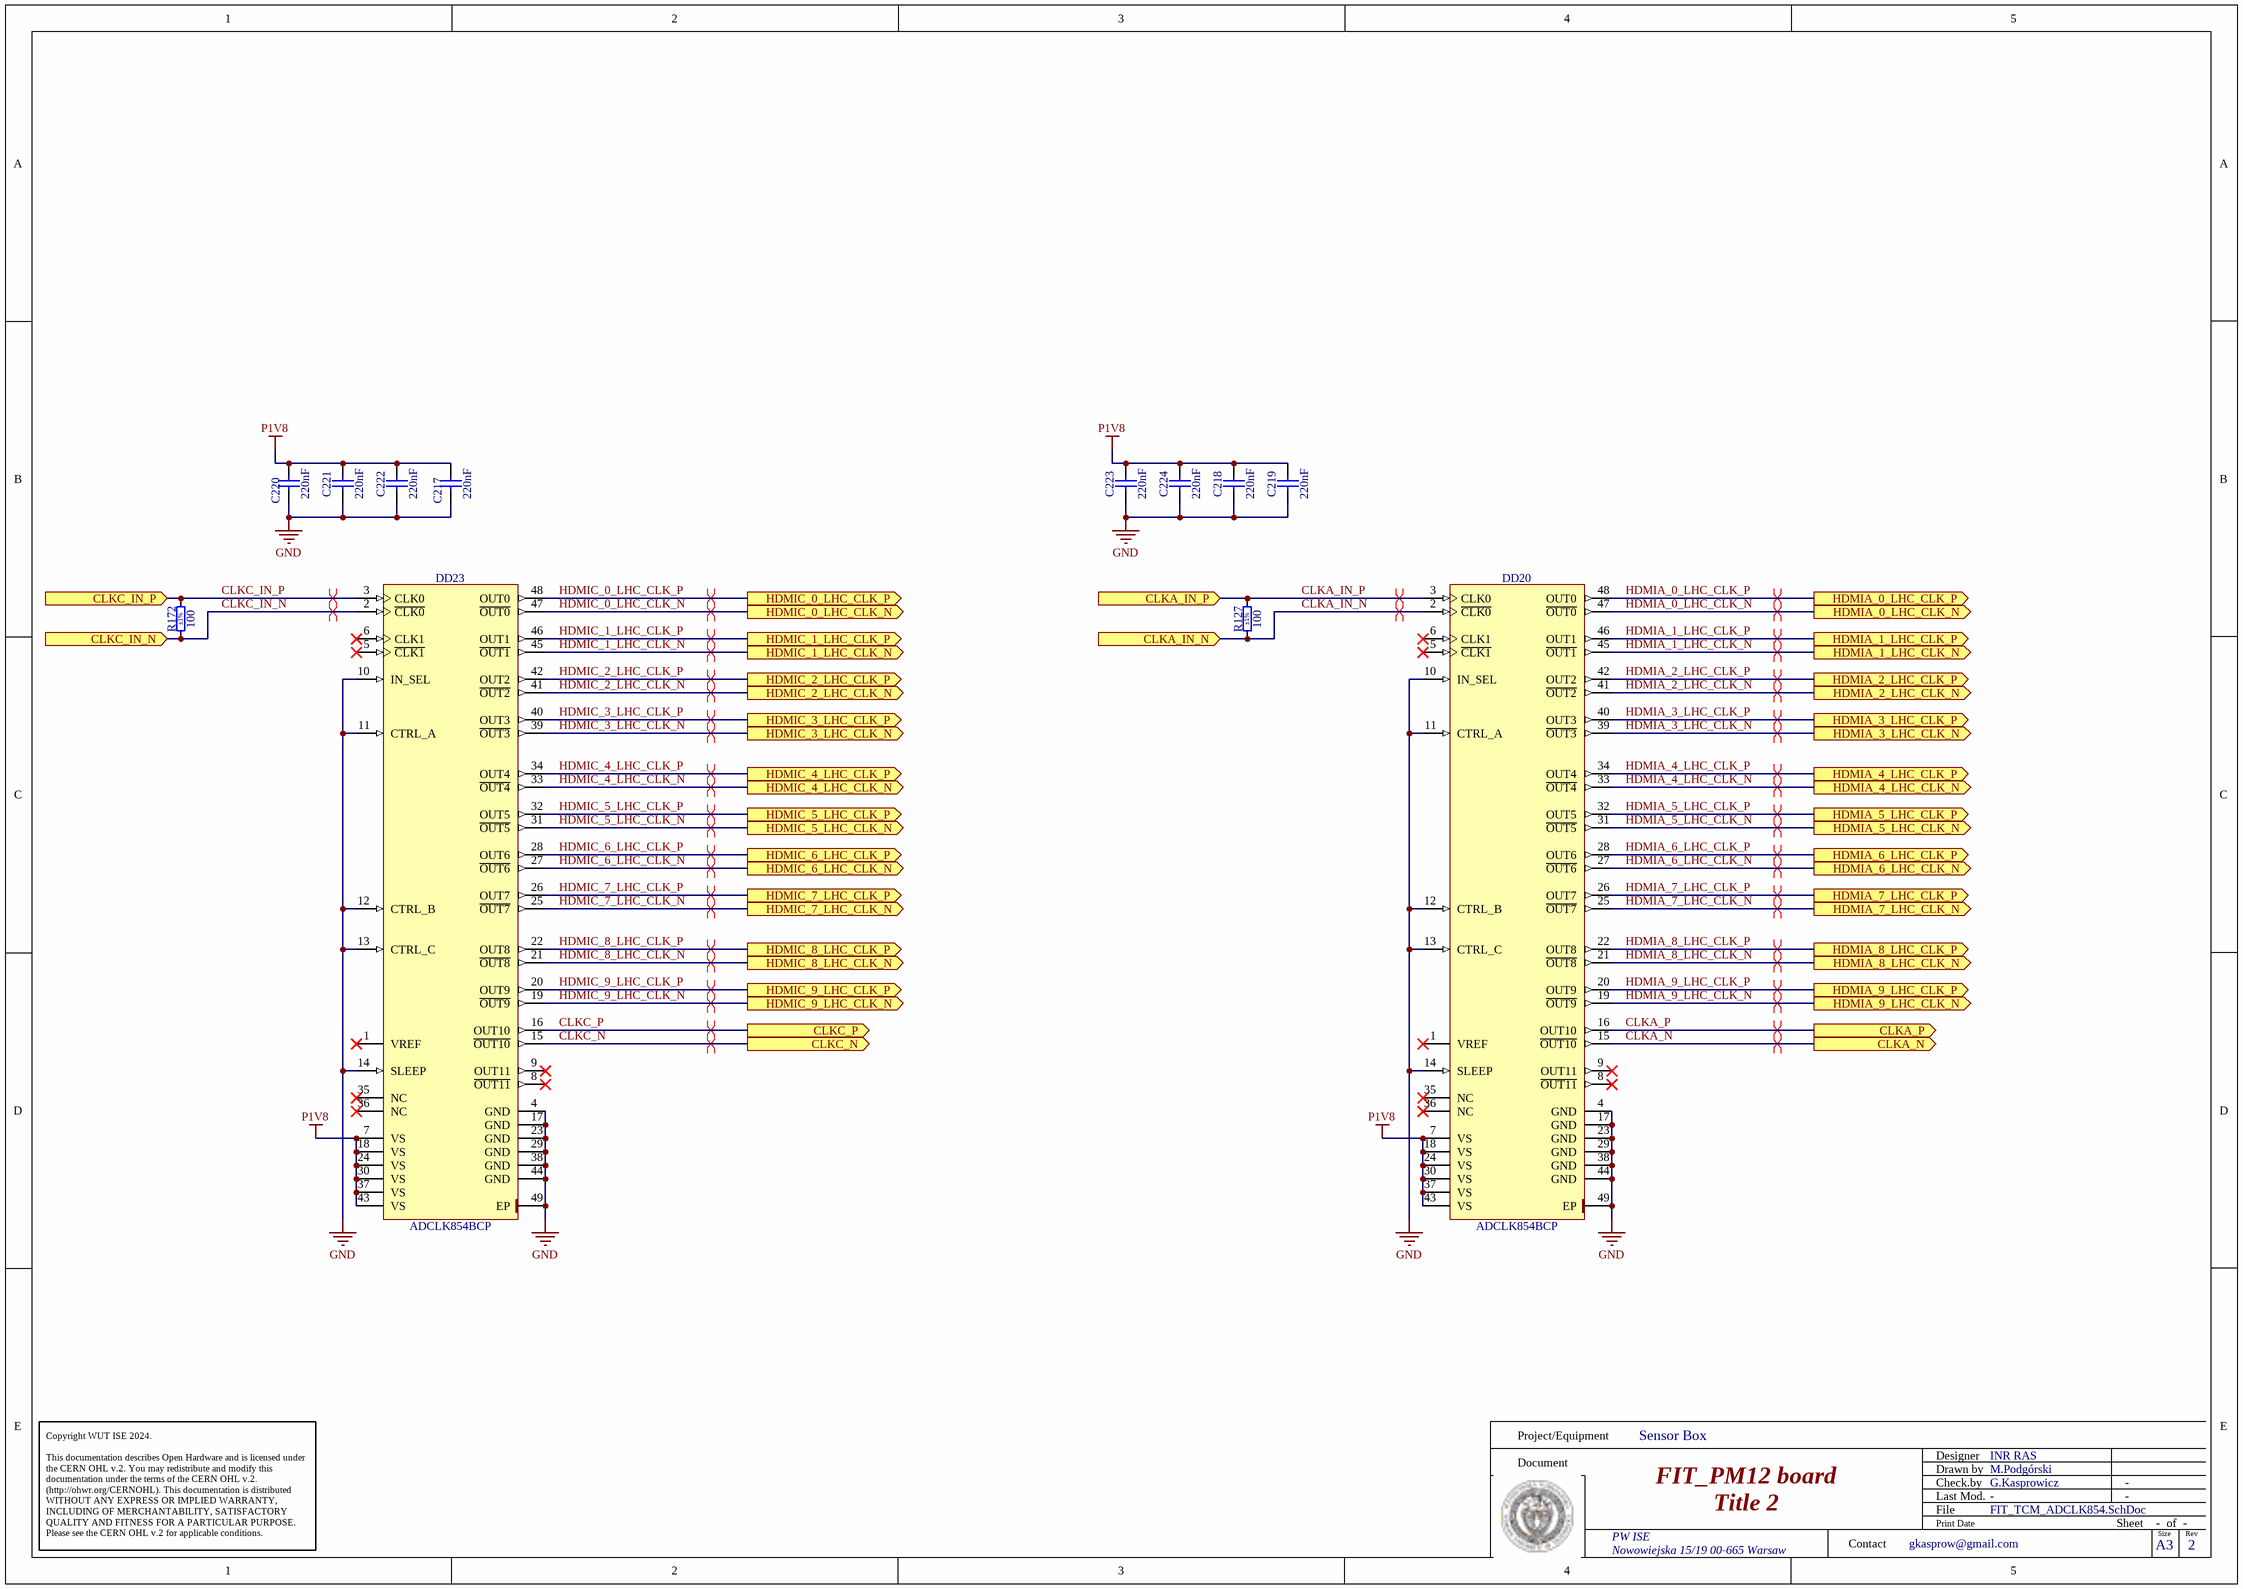
[diagram p3: FIT_TCM_ADCLK854.SchDoc]

### Parts
C217  220nF  [CAPC2012X135N]
C218  220nF  [CAPC2012X135N]
C219  220nF  [CAPC2012X135N]
C220  220nF  [CAPC2012X135N]
C221  220nF  [CAPC2012X135N]
C222  220nF  [CAPC2012X135N]
C223  220nF  [CAPC2012X135N]
C224  220nF  [CAPC2012X135N]
DD20  ADCLK854BCP  [QFN50P700X700X80-49N-S290]
DD23  ADCLK854BCP  [QFN50P700X700X80-49N-S290]
R127  100  Tolerance: ±1%  [RESC1608X55N]
R172  100  Tolerance: ±1%  [RESC1608X55N]

### Ports
CLKA_IN_N (in), CLKA_IN_P (in), CLKA_N (out), CLKA_P (out), CLKC_IN_N (in), CLKC_IN_P (in), CLKC_N (out), CLKC_P (out), HDMIA_0_LHC_CLK_N (out), HDMIA_0_LHC_CLK_P (out), HDMIA_1_LHC_CLK_N (out), HDMIA_1_LHC_CLK_P (out), HDMIA_2_LHC_CLK_N (out), HDMIA_2_LHC_CLK_P (out), HDMIA_3_LHC_CLK_N (out), HDMIA_3_LHC_CLK_P (out), HDMIA_4_LHC_CLK_N (out), HDMIA_4_LHC_CLK_P (out), HDMIA_5_LHC_CLK_N (out), HDMIA_5_LHC_CLK_P (out), HDMIA_6_LHC_CLK_N (out), HDMIA_6_LHC_CLK_P (out), HDMIA_7_LHC_CLK_N (out), HDMIA_7_LHC_CLK_P (out), HDMIA_8_LHC_CLK_N (out), HDMIA_8_LHC_CLK_P (out), HDMIA_9_LHC_CLK_N (out), HDMIA_9_LHC_CLK_P (out), HDMIC_0_LHC_CLK_N (out), HDMIC_0_LHC_CLK_P (out), HDMIC_1_LHC_CLK_N (out), HDMIC_1_LHC_CLK_P (out), HDMIC_2_LHC_CLK_N (out), HDMIC_2_LHC_CLK_P (out), HDMIC_3_LHC_CLK_N (out), HDMIC_3_LHC_CLK_P (out), HDMIC_4_LHC_CLK_N (out), HDMIC_4_LHC_CLK_P (out), HDMIC_5_LHC_CLK_N (out), HDMIC_5_LHC_CLK_P (out), HDMIC_6_LHC_CLK_N (out), HDMIC_6_LHC_CLK_P (out), HDMIC_7_LHC_CLK_N (out), HDMIC_7_LHC_CLK_P (out), HDMIC_8_LHC_CLK_N (out), HDMIC_8_LHC_CLK_P (out), HDMIC_9_LHC_CLK_N (out), HDMIC_9_LHC_CLK_P (out)

### Nets
GND: C217.1 C218.1 C219.1 C220.1 C221.1 C222.1 C223.1 C224.1 DD20.4(GND) DD20.10(IN_SEL) DD20.11(CTRL_A) DD20.12(CTRL_B) DD20.13(CTRL_C) DD20.14(SLEEP) DD20.17(GND) DD20.23(GND) DD20.29(GND) DD20.38(GND) DD20.44(GND) DD20.49(EP) DD23.4(GND) DD23.10(IN_SEL) DD23.11(CTRL_A) DD23.12(CTRL_B) DD23.13(CTRL_C) DD23.14(SLEEP) DD23.17(GND) DD23.23(GND) DD23.29(GND) DD23.38(GND) DD23.44(GND) DD23.49(EP)
P1V8: C217.2 C218.2 C219.2 C220.2 C221.2 C222.2 C223.2 C224.2 DD20.7(VS) DD20.18(VS) DD20.24(VS) DD20.30(VS) DD20.37(VS) DD20.43(VS) DD23.7(VS) DD23.18(VS) DD23.24(VS) DD23.30(VS) DD23.37(VS) DD23.43(VS)
CLKA_IN_N: DD20.2(~{CLK0}) R127.1 ; port CLKA_IN_N
CLKA_IN_P: DD20.3(CLK0) R127.2 ; port CLKA_IN_P
CLKA_N: DD20.15(~{OUT10}) ; port CLKA_N
CLKA_P: DD20.16(OUT10) ; port CLKA_P
CLKC_IN_N: DD23.2(~{CLK0}) R172.1 ; port CLKC_IN_N
CLKC_IN_P: DD23.3(CLK0) R172.2 ; port CLKC_IN_P
CLKC_N: DD23.15(~{OUT10}) ; port CLKC_N
CLKC_P: DD23.16(OUT10) ; port CLKC_P
HDMIA_0_LHC_CLK_N: DD20.47(~{OUT0}) ; port HDMIA_0_LHC_CLK_N  [project net HDMIA_LHC.0_LHC_CLK_N]
HDMIA_0_LHC_CLK_P: DD20.48(OUT0) ; port HDMIA_0_LHC_CLK_P  [project net HDMIA_LHC.0_LHC_CLK_P]
HDMIA_1_LHC_CLK_N: DD20.45(~{OUT1}) ; port HDMIA_1_LHC_CLK_N  [project net HDMIA_LHC.1_LHC_CLK_N]
HDMIA_1_LHC_CLK_P: DD20.46(OUT1) ; port HDMIA_1_LHC_CLK_P  [project net HDMIA_LHC.1_LHC_CLK_P]
HDMIA_2_LHC_CLK_N: DD20.41(~{OUT2}) ; port HDMIA_2_LHC_CLK_N  [project net HDMIA_LHC.2_LHC_CLK_N]
HDMIA_2_LHC_CLK_P: DD20.42(OUT2) ; port HDMIA_2_LHC_CLK_P  [project net HDMIA_LHC.2_LHC_CLK_P]
HDMIA_3_LHC_CLK_N: DD20.39(~{OUT3}) ; port HDMIA_3_LHC_CLK_N  [project net HDMIA_LHC.3_LHC_CLK_N]
HDMIA_3_LHC_CLK_P: DD20.40(OUT3) ; port HDMIA_3_LHC_CLK_P  [project net HDMIA_LHC.3_LHC_CLK_P]
HDMIA_4_LHC_CLK_N: DD20.33(~{OUT4}) ; port HDMIA_4_LHC_CLK_N  [project net HDMIA_LHC.4_LHC_CLK_N]
HDMIA_4_LHC_CLK_P: DD20.34(OUT4) ; port HDMIA_4_LHC_CLK_P  [project net HDMIA_LHC.4_LHC_CLK_P]
HDMIA_5_LHC_CLK_N: DD20.31(~{OUT5}) ; port HDMIA_5_LHC_CLK_N  [project net HDMIA_LHC.5_LHC_CLK_N]
HDMIA_5_LHC_CLK_P: DD20.32(OUT5) ; port HDMIA_5_LHC_CLK_P  [project net HDMIA_LHC.5_LHC_CLK_P]
HDMIA_6_LHC_CLK_N: DD20.27(~{OUT6}) ; port HDMIA_6_LHC_CLK_N  [project net HDMIA_LHC.6_LHC_CLK_N]
HDMIA_6_LHC_CLK_P: DD20.28(OUT6) ; port HDMIA_6_LHC_CLK_P  [project net HDMIA_LHC.6_LHC_CLK_P]
HDMIA_7_LHC_CLK_N: DD20.25(~{OUT7}) ; port HDMIA_7_LHC_CLK_N  [project net HDMIA_LHC.7_LHC_CLK_N]
HDMIA_7_LHC_CLK_P: DD20.26(OUT7) ; port HDMIA_7_LHC_CLK_P  [project net HDMIA_LHC.7_LHC_CLK_P]
HDMIA_8_LHC_CLK_N: DD20.21(~{OUT8}) ; port HDMIA_8_LHC_CLK_N  [project net HDMIA_LHC.8_LHC_CLK_N]
HDMIA_8_LHC_CLK_P: DD20.22(OUT8) ; port HDMIA_8_LHC_CLK_P  [project net HDMIA_LHC.8_LHC_CLK_P]
HDMIA_9_LHC_CLK_N: DD20.19(~{OUT9}) ; port HDMIA_9_LHC_CLK_N  [project net HDMIA_LHC.9_LHC_CLK_N]
HDMIA_9_LHC_CLK_P: DD20.20(OUT9) ; port HDMIA_9_LHC_CLK_P  [project net HDMIA_LHC.9_LHC_CLK_P]
HDMIC_0_LHC_CLK_N: DD23.47(~{OUT0}) ; port HDMIC_0_LHC_CLK_N  [project net HDMIC_LHC.0_LHC_CLK_N]
HDMIC_0_LHC_CLK_P: DD23.48(OUT0) ; port HDMIC_0_LHC_CLK_P  [project net HDMIC_LHC.0_LHC_CLK_P]
HDMIC_1_LHC_CLK_N: DD23.45(~{OUT1}) ; port HDMIC_1_LHC_CLK_N  [project net HDMIC_LHC.1_LHC_CLK_N]
HDMIC_1_LHC_CLK_P: DD23.46(OUT1) ; port HDMIC_1_LHC_CLK_P  [project net HDMIC_LHC.1_LHC_CLK_P]
HDMIC_2_LHC_CLK_N: DD23.41(~{OUT2}) ; port HDMIC_2_LHC_CLK_N  [project net HDMIC_LHC.2_LHC_CLK_N]
HDMIC_2_LHC_CLK_P: DD23.42(OUT2) ; port HDMIC_2_LHC_CLK_P  [project net HDMIC_LHC.2_LHC_CLK_P]
HDMIC_3_LHC_CLK_N: DD23.39(~{OUT3}) ; port HDMIC_3_LHC_CLK_N  [project net HDMIC_LHC.3_LHC_CLK_N]
HDMIC_3_LHC_CLK_P: DD23.40(OUT3) ; port HDMIC_3_LHC_CLK_P  [project net HDMIC_LHC.3_LHC_CLK_P]
HDMIC_4_LHC_CLK_N: DD23.33(~{OUT4}) ; port HDMIC_4_LHC_CLK_N  [project net HDMIC_LHC.4_LHC_CLK_N]
HDMIC_4_LHC_CLK_P: DD23.34(OUT4) ; port HDMIC_4_LHC_CLK_P  [project net HDMIC_LHC.4_LHC_CLK_P]
HDMIC_5_LHC_CLK_N: DD23.31(~{OUT5}) ; port HDMIC_5_LHC_CLK_N  [project net HDMIC_LHC.5_LHC_CLK_N]
HDMIC_5_LHC_CLK_P: DD23.32(OUT5) ; port HDMIC_5_LHC_CLK_P  [project net HDMIC_LHC.5_LHC_CLK_P]
HDMIC_6_LHC_CLK_N: DD23.27(~{OUT6}) ; port HDMIC_6_LHC_CLK_N  [project net HDMIC_LHC.6_LHC_CLK_N]
HDMIC_6_LHC_CLK_P: DD23.28(OUT6) ; port HDMIC_6_LHC_CLK_P  [project net HDMIC_LHC.6_LHC_CLK_P]
HDMIC_7_LHC_CLK_N: DD23.25(~{OUT7}) ; port HDMIC_7_LHC_CLK_N  [project net HDMIC_LHC.7_LHC_CLK_N]
HDMIC_7_LHC_CLK_P: DD23.26(OUT7) ; port HDMIC_7_LHC_CLK_P  [project net HDMIC_LHC.7_LHC_CLK_P]
HDMIC_8_LHC_CLK_N: DD23.21(~{OUT8}) ; port HDMIC_8_LHC_CLK_N  [project net HDMIC_LHC.8_LHC_CLK_N]
HDMIC_8_LHC_CLK_P: DD23.22(OUT8) ; port HDMIC_8_LHC_CLK_P  [project net HDMIC_LHC.8_LHC_CLK_P]
HDMIC_9_LHC_CLK_N: DD23.19(~{OUT9}) ; port HDMIC_9_LHC_CLK_N  [project net HDMIC_LHC.9_LHC_CLK_N]
HDMIC_9_LHC_CLK_P: DD23.20(OUT9) ; port HDMIC_9_LHC_CLK_P  [project net HDMIC_LHC.9_LHC_CLK_P]

Not connected (* = marked no-connect by the designer): DD20 1(VREF)* 5(~{CLK1})* 6(CLK1)* 8(~{OUT11})* 9(OUT11)* 35(NC)* 36(NC)*; DD23 1(VREF)* 5(~{CLK1})* 6(CLK1)* 8(~{OUT11})* 9(OUT11)* 35(NC)* 36(NC)*

### Layout directives
differential pair: CLKA_IN_N, CLKA_IN_P, CLKA_N, CLKA_P, CLKC_IN_N, CLKC_IN_P, CLKC_N, CLKC_P, HDMIA_LHC.0_LHC_CLK_N, HDMIA_LHC.0_LHC_CLK_P, HDMIA_LHC.1_LHC_CLK_N, HDMIA_LHC.1_LHC_CLK_P, HDMIA_LHC.2_LHC_CLK_N, HDMIA_LHC.2_LHC_CLK_P, HDMIA_LHC.3_LHC_CLK_N, HDMIA_LHC.3_LHC_CLK_P, HDMIA_LHC.4_LHC_CLK_N, HDMIA_LHC.4_LHC_CLK_P, HDMIA_LHC.5_LHC_CLK_N, HDMIA_LHC.5_LHC_CLK_P, HDMIA_LHC.6_LHC_CLK_N, HDMIA_LHC.6_LHC_CLK_P, HDMIA_LHC.7_LHC_CLK_N, HDMIA_LHC.7_LHC_CLK_P, HDMIA_LHC.8_LHC_CLK_N, HDMIA_LHC.8_LHC_CLK_P, HDMIA_LHC.9_LHC_CLK_N, HDMIA_LHC.9_LHC_CLK_P, HDMIC_LHC.0_LHC_CLK_N, HDMIC_LHC.0_LHC_CLK_P, HDMIC_LHC.1_LHC_CLK_N, HDMIC_LHC.1_LHC_CLK_P, HDMIC_LHC.2_LHC_CLK_N, HDMIC_LHC.2_LHC_CLK_P, HDMIC_LHC.3_LHC_CLK_N, HDMIC_LHC.3_LHC_CLK_P, HDMIC_LHC.4_LHC_CLK_N, HDMIC_LHC.4_LHC_CLK_P, HDMIC_LHC.5_LHC_CLK_N, HDMIC_LHC.5_LHC_CLK_P, HDMIC_LHC.6_LHC_CLK_N, HDMIC_LHC.6_LHC_CLK_P, HDMIC_LHC.7_LHC_CLK_N, HDMIC_LHC.7_LHC_CLK_P, HDMIC_LHC.8_LHC_CLK_N, HDMIC_LHC.8_LHC_CLK_P, HDMIC_LHC.9_LHC_CLK_N, HDMIC_LHC.9_LHC_CLK_P

### Notes on the sheet
- Project/Equipment
- Document
- Designer
- Drawn by
- Check.by
- Copyright WUT ISE 2024.
  This documentation describes Open Hardware and is licensed under the CERN OHL v.2. You may redistribute and modify this documentation under the terms of the CERN OHL v.2. (http://ohwr.org/CERNOHL). This documentation is distributed WITHOUT ANY EXPRESS OR IMPLIED WARRANTY, INCLUDING OF MERCHANTABILITY, SATISFACTORY QUALITY AND FITNESS FOR A PARTICULAR PURPOSE. Please see the CERN OHL v.2 for applicable conditions.
- Contact
- File
- Last Mod.
- Print Date
- Sheet
- Size
- A3
- of
- Rev

### Library data of the parts
C217-C224 = CC0805_220NF_50V_10%_X7R: as C71 on sheet FIT_TCM_ATxmega; Part Number: CC0805_220NF_50V_10%_X7R; Component Kind: Standard; Component Type: Standard; Pin Count: 2; Value: 220nF; Status: Preferred; Manufacturer Part Number: CC0805_220NF_50V_10%_X7R; Case: 0805; Mounted: Yes; Socket: No; SMD: Yes; Sense: No; Manufacturer1 Example: MURATA; Manufacturer1 ComponentHeight: 1.35mm; HelpURL: \\cern.ch\dfs\Applications\Altium\Datasheets\CC0805_X7R_MURATA.pdf; Author: CERN DEM JLC; CreateDate: 03.12.2007; LatestRevisionDate: 03.12.2007
DD20 DD23 = ADCLK854BCP: 1.8 V, 6 LVDS/12 CMOS Outputs Low Power Clock Fanout Buffer; Manufacturer: ANALOG DEVICES; PressFit: No; Bonding: No; Part Number: ADCLK854BCP; Component Kind: Standard; Component Type: Standard; Device: ADCLK854BCP; PackageDescription: QFN, 0.50mm Pitch, Square; 48 Pin, 7.00mm L X 7.00mm W X 0.80mm H body (w/Thermal Tab 2.9 x 2.9mm), IPC Medium Density; Part Description: 1.8 V, 6 LVDS/12 CMOS Outputs Low Power Clock Fanout Buffer; Manufacturer Part Number: ADCLK854BCP; Pin Count: 49; Case: QFN48; Mounted: Yes; Socket: No; SMD: Yes; Sense: No; ComponentHeight: 0.8mm; Author: CERN DEM HF; HelpURL: \\cern.ch\dfs\Applications\Altium\Datasheets\ADCLK854BCP.pdf; CreateDate: 24.05.2024; LatestRevisionDate: 24.05.2024
R127 R172 = R0603_100R_1%_0.1W_100PPM: as R14 on sheet FIT_TCM_Main_PLL; Part Number: R0603_100R_1%_0.1W_100PPM; Component Kind: Standard; Component Type: Standard; Pin Count: 2; Value: 100; Status: Preferred; Manufacturer Part Number: R0603_100R_1%_0.1W_100PPM; Case: 0603; Mounted: Yes; Sense: No; Socket: No; SMD: Yes; Manufacturer1 Example: NIC COMPONENT; Manufacturer1 ComponentHeight: 0.55mm; HelpURL: \\cern.ch\dfs\Applications\Altium\Datasheets\R0603_NIC_NRC.pdf; Author: CERN DEM JLC; CreateDate: 03.12.2007; LatestRevisionDate: 13.03.2008

## Sheet FIT_TCM_SI5338A.SchDoc: FIT_PM12 board
size 420 x 297 mm; CheckedBy: G.Kasprowicz; Author: INR Moscow; CompanyName: WUT ISE; DrawnBy: M.Podgórski; Organization: WUT ISE; Address1: PW ISE; Address2: Nowowiejska 15/19 00-665 Warsaw; Address3: gkasprow@gmail.com; Revision: 2; SheetNumber: -; SheetTotal: -; ModifiedBy: -; CheckedDate: -; Title2: Title 2; DivGrp: WUT ISE; Designer: INR RAS; ModifiedDate: -; ProjectName: Sensor Box
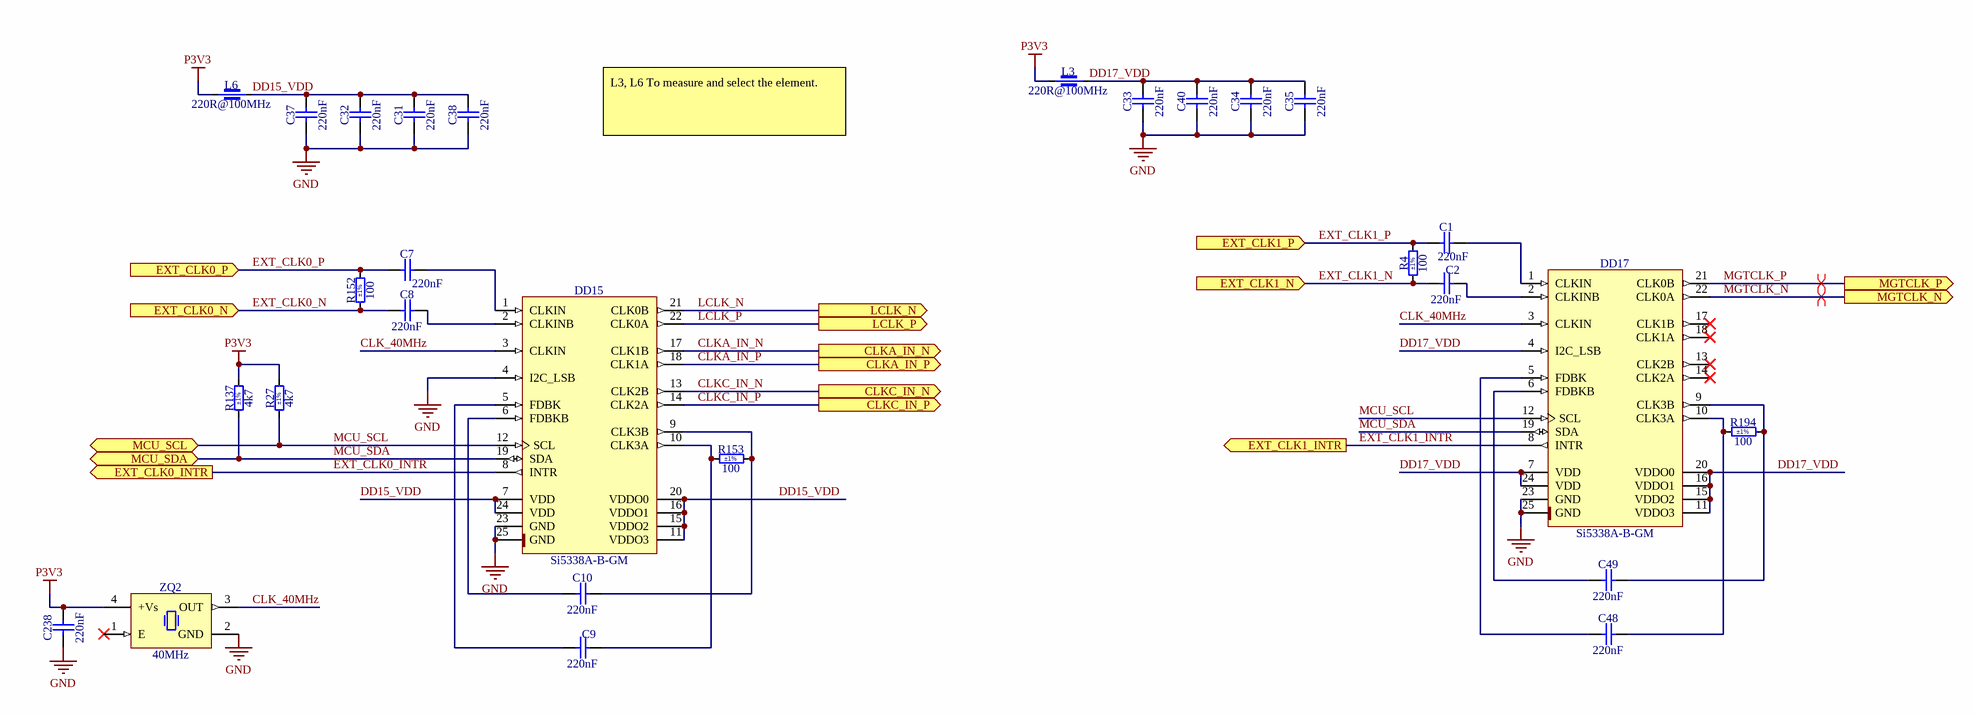
[diagram p4: FIT_TCM_SI5338A.SchDoc]

### Parts
C1  220nF  [CAPC1608X87N]
C2  220nF  [CAPC1608X87N]
C7  220nF  [CAPC1608X87N]
C8  220nF  [CAPC1608X87N]
C9  220nF  [CAPC1608X87N]
C10  220nF  [CAPC1608X87N]
C31  220nF  [CAPC2012X135N]
C32  220nF  [CAPC2012X135N]
C33  220nF  [CAPC2012X135N]
C34  220nF  [CAPC2012X135N]
C35  220nF  [CAPC2012X135N]
C37  220nF  [CAPC2012X135N]
C38  220nF  [CAPC2012X135N]
C40  220nF  [CAPC2012X135N]
C48  220nF  [CAPC1608X87N]
C49  220nF  [CAPC1608X87N]
C238  220nF  [CAPC2012X135N]
DD15  Si5338A-B-GM  [QFN50P400X400X90-25N-S265]
DD17  Si5338A-B-GM  [QFN50P400X400X90-25N-S265]
L3  220R@100MHz  [INDC2012X105N]
L6  220R@100MHz  [INDC2012X105N]
R4  100  Tolerance: ±1%  [RESC1608X55N]
R27  4k7  Tolerance: ±1%  [RESC2012X60N]
R137  4k7  Tolerance: ±1%  [RESC2012X60N]
R152  100  Tolerance: ±1%  [RESC1608X55N]
R153  100  Tolerance: ±1%  [RESC1608X55N]
R194  100  Tolerance: ±1%  [RESC1608X55N]
ZQ2  40MHz  [OSC_IQD_CFPS-73]

### Ports
CLKA_IN_N (out), CLKA_IN_P (out), CLKC_IN_N (out), CLKC_IN_P (out), EXT_CLK0_INTR (out), EXT_CLK0_N (in), EXT_CLK0_P (in), EXT_CLK1_INTR (out), EXT_CLK1_N (in), EXT_CLK1_P (in), LCLK_N (out), LCLK_P (out), MCU_SCL (bidir), MCU_SDA (bidir), MGTCLK_N (out), MGTCLK_P (out)

### Nets
GND: C31.1 C32.1 C33.1 C34.1 C35.1 C37.1 C38.1 C40.1 C238.1 DD15.4(I2C_LSB) DD15.23(GND) DD15.25(GND) DD17.23(GND) DD17.25(GND) ZQ2.2(GND)
P3V3: C238.2 L3.1 L6.1 R27.2 R137.2 ZQ2.4(+Vs)
CLK_40MHz: DD15.3(CLKIN) DD17.3(CLKIN) ZQ2.3(OUT)
CLKA_IN_N: DD15.17(CLK1B) ; port CLKA_IN_N
CLKA_IN_P: DD15.18(CLK1A) ; port CLKA_IN_P
CLKC_IN_N: DD15.13(CLK2B) ; port CLKC_IN_N
CLKC_IN_P: DD15.14(CLK2A) ; port CLKC_IN_P
DD15_VDD: C31.2 C32.2 C37.2 C38.2 DD15.7(VDD) DD15.11(VDDO3) DD15.15(VDDO2) DD15.16(VDDO1) DD15.20(VDDO0) DD15.24(VDD) L6.2
DD17_VDD: C33.2 C34.2 C35.2 C40.2 DD17.4(I2C_LSB) DD17.7(VDD) DD17.11(VDDO3) DD17.15(VDDO2) DD17.16(VDDO1) DD17.20(VDDO0) DD17.24(VDD) L3.2
EXT_CLK0_INTR: DD15.8(INTR) ; port EXT_CLK0_INTR
EXT_CLK0_N: C8.1 R152.1 ; port EXT_CLK0_N
EXT_CLK0_P: C7.1 R152.2 ; port EXT_CLK0_P
EXT_CLK1_INTR: DD17.8(INTR) ; port EXT_CLK1_INTR
EXT_CLK1_N: C2.1 R4.1 ; port EXT_CLK1_N
EXT_CLK1_P: C1.1 R4.2 ; port EXT_CLK1_P
LCLK_N: DD15.21(CLK0B) ; port LCLK_N
LCLK_P: DD15.22(CLK0A) ; port LCLK_P
MCU_SCL: DD15.12(SCL) DD17.12(SCL) R27.1 ; port MCU_SCL
MCU_SDA: DD15.19(SDA) DD17.19(SDA) R137.1 ; port MCU_SDA
MGTCLK_N: DD17.22(CLK0A) ; port MGTCLK_N
MGTCLK_P: DD17.21(CLK0B) ; port MGTCLK_P
NetC1_2: C1.2 DD17.1(CLKIN)
NetC2_2: C2.2 DD17.2(CLKINB)
NetC7_2: C7.2 DD15.1(CLKIN)
NetC8_2: C8.2 DD15.2(CLKINB)
NetC9_1: C9.1 DD15.5(FDBK)
NetC9_2: C9.2 DD15.10(CLK3A) R153.1
NetC10_1: C10.1 DD15.6(FDBKB)
NetC10_2: C10.2 DD15.9(CLK3B) R153.2
NetC48_1: C48.1 DD17.5(FDBK)
NetC48_2: C48.2 DD17.10(CLK3A) R194.1
NetC49_1: C49.1 DD17.6(FDBKB)
NetC49_2: C49.2 DD17.9(CLK3B) R194.2

Not connected (* = marked no-connect by the designer): DD17 13(CLK2B)* 14(CLK2A)* 17(CLK1B)* 18(CLK1A)*; ZQ2 1(E)*

### Layout directives
differential pair: MGTCLK_N, MGTCLK_P

### Notes on the sheet
- L3, L6 To measure and select the element.
- Project/Equipment
- Document
- Designer
- Drawn by
- Check.by
- Copyright WUT ISE 2024.
  This documentation describes Open Hardware and is licensed under the CERN OHL v.2. You may redistribute and modify this documentation under the terms of the CERN OHL v.2. (http://ohwr.org/CERNOHL). This documentation is distributed WITHOUT ANY EXPRESS OR IMPLIED WARRANTY, INCLUDING OF MERCHANTABILITY, SATISFACTORY QUALITY AND FITNESS FOR A PARTICULAR PURPOSE. Please see the CERN OHL v.2 for applicable conditions.
- Contact
- File
- Last Mod.
- Print Date
- Sheet
- Size
- A3
- of
- Rev

### Library data of the parts
C1 C2 C7-C10 C48 C49 = CC0603_220NF_25V_10%_X7R: Non-polarised capacitor; Part Description: SMD Multilayer Chip Ceramic Capacitor; Manufacturer: GENERIC; Manufacturer1 Part Number: C0603C224K3RACTU; Voltage: 25V; TC: X7R; Tolerance: ±10%; Part Number: CC0603_220NF_25V_10%_X7R; Component Kind: Standard; Component Type: Standard; Pin Count: 2; Value: 220nF; Status: Preferred; Manufacturer Part Number: CC0603_220NF_25V_10%_X7R; Case: 0603; Mounted: Yes; Socket: No; SMD: Yes; Sense: No; Manufacturer1 Example: KEMET; Manufacturer1 ComponentHeight: 0.87mm; HelpURL: \\cern.ch\dfs\Applications\Altium\Datasheets\CC0603_X7R_KEMET.pdf; Author: CERN DEM JLC; CreateDate: 29.10.2014; LatestRevisionDate: 29.10.2014
C31-C35 C37 C38 C40 C238 = CC0805_220NF_50V_10%_X7R: Non-polarised capacitor; Part Description: SMD Multilayer Chip Ceramic Capacitor; Manufacturer: GENERIC; Manufacturer1 Part Number: GRM21BR71H224KA01L; Voltage: 50V; TC: X7R; Tolerance: ±10%; Part Number: CC0805_220NF_50V_10%_X7R; Component Kind: Standard; Component Type: Standard; Pin Count: 2; Value: 220nF; Status: Preferred; Manufacturer Part Number: CC0805_220NF_50V_10%_X7R; Case: 0805; Mounted: Yes; Socket: No; SMD: Yes; Sense: No; Manufacturer1 Example: MURATA; Manufacturer1 ComponentHeight: 1.35mm; HelpURL: \\cern.ch\dfs\Applications\Altium\Datasheets\CC0805_X7R_MURATA.pdf; Author: CERN DEM JLC; CreateDate: 03.12.2007; LatestRevisionDate: 03.12.2007
DD15 DD17 = Si5338A-B-GM: I2C-Programmable Any-Frequency, Any-Output Quad Clock Generator; Part Description: 0.16 MHz to 710 MHz I2C_LSB, I2C-Programmable Quad Clock Generator; Manufacturer: SILICON LABS; PressFit: No; Bonding: No; Part Number: Si5338A-B-GM; Component Kind: Standard; Component Type: Standard; Device: Si5338A-B-GM; PackageDescription: QFN, 0.50mm Pitch, Square; 24 Pin, 4.00mm L X 4.00mm W X 0.90mm H body (w/Thermal Tab 2.65 X 2.65mm), IPC Medium Density; Manufacturer Part Number: Si5338A-B-GM; Pin Count: 25; Case: QFN24; Mounted: Yes; Socket: No; SMD: Yes; Sense: No; ComponentHeight: 0.9mm; HelpURL: \\cern.ch\dfs\Applications\Altium\Datasheets\Si5338A-B-GM.pdf; Author: CERN DEM JMW; CreateDate: 07.02.2020; LatestRevisionDate: 07.02.2020
L3 L6 = IND0805_TDK_MPZ2012S221A: Part Description: SMT Chip Bead for General Power Line (MPZ Series); Manufacturer: TDK; Power: 3A; Resistance: 0.04R; Tolerance: ±25%; Part Number: IND0805_TDK_MPZ2012S221A; Component Kind: Standard; Component Type: Standard; Pin Count: 2; Value: 220R@100MHz; Manufacturer Part Number: MPZ2012S221A; Case: 0805; Mounted: Yes; Socket: No; SMD: Yes; Sense: No; ComponentHeight: 1.05mm; HelpURL: \\cern.ch\dfs\Applications\Altium\Datasheets\IND0805_TDK_MPZ2012.pdf; Author: CERN DEM HF; CreateDate: 04.10.2021; LatestRevisionDate: 04.10.2021
R4 R152 R153 R194 = R0603_100R_1%_0.1W_100PPM: Resistor - 1%; Part Description: General Purpose Thick Film Chip Resistor; Manufacturer: GENERIC; Manufacturer1 Part Number: NRC06F4700TRF; Power: 0.1W; TC: ±100ppm/°C; PressFit: No; Part Number: R0603_100R_1%_0.1W_100PPM; Component Kind: Standard; Component Type: Standard; Pin Count: 2; Value: 100; Status: Preferred; Manufacturer Part Number: R0603_100R_1%_0.1W_100PPM; Case: 0603; Mounted: Yes; Sense: No; Socket: No; SMD: Yes; Manufacturer1 Example: NIC COMPONENT; Manufacturer1 ComponentHeight: 0.55mm; HelpURL: \\cern.ch\dfs\Applications\Altium\Datasheets\R0603_NIC_NRC.pdf; Author: CERN DEM JLC; CreateDate: 03.12.2007; LatestRevisionDate: 13.03.2008
R27 R137 = R0805_4K7_1%_0.125W_100PPM: Resistor - 1%; Part Description: General Purpose Thick Film Chip Resistor; Manufacturer: GENERIC; Manufacturer1 Part Number: NRC10F4701TRF; Power: 0.125W; TC: ±100ppm/°C; PressFit: No; Part Number: R0805_4K7_1%_0.125W_100PPM; Component Kind: Standard; Component Type: Standard; Pin Count: 2; Value: 4k7; Status: Preferred; Manufacturer Part Number: R0805_4K7_1%_0.125W_100PPM; Case: 0805; Mounted: Yes; Sense: No; Socket: No; SMD: Yes; Manufacturer1 Example: NIC COMPONENT; Manufacturer1 ComponentHeight: 0.6mm; HelpURL: \\cern.ch\dfs\Applications\Altium\Datasheets\R0805_NIC_NRC.pdf; Author: CERN DEM JLC; CreateDate: 03.12.2007; LatestRevisionDate: 13.03.2008
ZQ2 = OSC_40MHZ_IQD_LFSPXO018042: Oscillator 4 pins 1=E 2=GND 3=OUT 4=+Vs; Part Description: 3.3V, ±50ppm, 50pF, 0..70°C, HCMOS Surface Mount Clock Oscillator (CFPS-73 Series); Manufacturer: IQD FREQUENCY PRODUCTS; PressFit: No; Bonding: No; Part Number: OSC_40MHZ_IQD_LFSPXO018042; Component Kind: Standard; Component Type: Standard; PackageDescription: Oscillator, Side Concave, 5.08mm Pitch, 4 Pins, 5.00mm L X 7.00mm W X 1.40mm H, CFPS-73 Series; Value: 40MHz; Manufacturer Part Number: LFSPXO018042; Pin Count: 4; Mounted: Yes; Socket: No; SMD: Yes; Sense: No; ComponentHeight: 1.4mm; HelpURL: \\cern.ch\dfs\Applications\Altium\Datasheets\OSC_IQD_LFSPXO018042.pdf; Author: CERN DEM JLC; CreateDate: 22.08.2011; LatestRevisionDate: 03.11.2016

## Sheet FIT_TCM_Power.SchDoc: FIT_PM12 board
size 420 x 297 mm; CheckedBy: G.Kasprowicz; Author: INR Moscow; CompanyName: WUT ISE; DrawnBy: M.Podgórski; Organization: WUT ISE; Address1: PW ISE; Address2: Nowowiejska 15/19 00-665 Warsaw; Address3: gkasprow@gmail.com; Revision: 2; SheetNumber: -; SheetTotal: -; ModifiedBy: -; CheckedDate: -; Title2: Title 2; DivGrp: WUT ISE; Designer: INR RAS; ModifiedDate: -; ProjectName: Sensor Box
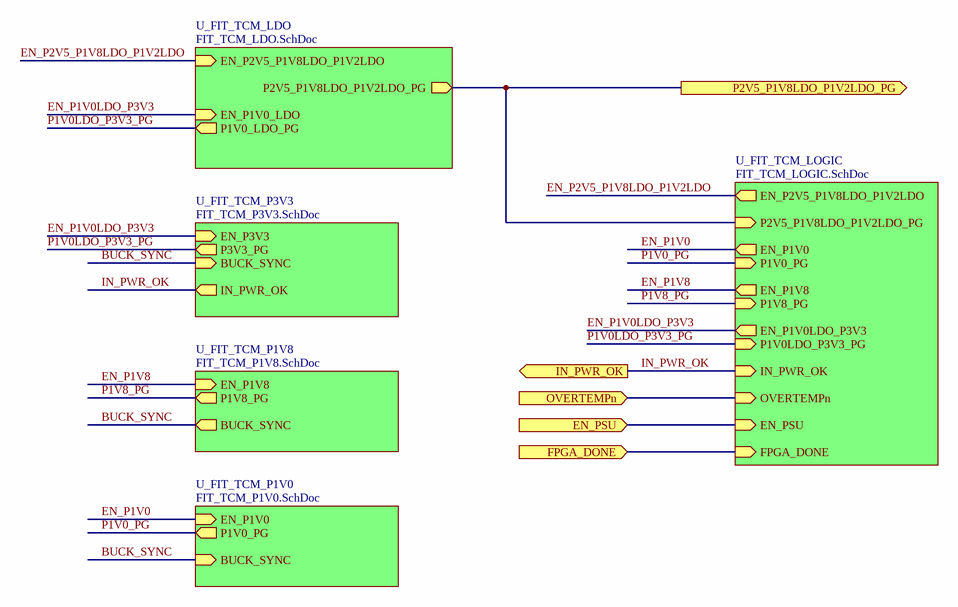
[diagram p5: FIT_TCM_Power.SchDoc]

### Sub-sheets
U_FIT_TCM_LDO = FIT_TCM_LDO.SchDoc: EN_P1V0_LDO (in), P1V0_LDO_PG (out), P2V5_P1V8LDO_P1V2LDO_PG (out), EN_P2V5_P1V8LDO_P1V2LDO (in)
U_FIT_TCM_LOGIC = FIT_TCM_LOGIC.SchDoc: IN_PWR_OK (in), EN_P1V0LDO_P3V3 (out), P1V0LDO_P3V3_PG (in), EN_P1V8 (out), P1V8_PG (in), EN_P1V0 (out), P1V0_PG (in), P2V5_P1V8LDO_P1V2LDO_PG (in), EN_P2V5_P1V8LDO_P1V2LDO (out), EN_PSU (in), OVERTEMPn (in), FPGA_DONE (in)
U_FIT_TCM_P1V0 = FIT_TCM_P1V0.SchDoc: BUCK_SYNC (in), EN_P1V0 (in), P1V0_PG (out)
U_FIT_TCM_P1V8 = FIT_TCM_P1V8.SchDoc: BUCK_SYNC (out), EN_P1V8 (in), P1V8_PG (out)
U_FIT_TCM_P3V3 = FIT_TCM_P3V3.SchDoc: IN_PWR_OK (out), EN_P3V3 (in), BUCK_SYNC (in), P3V3_PG (out)

### Ports
EN_PSU (in), FPGA_DONE (in), IN_PWR_OK (out), OVERTEMPn (in), P2V5_P1V8LDO_P1V2LDO_PG (out)

### Nets
BUCK_SYNC: sheet U_FIT_TCM_P1V0/BUCK_SYNC, sheet U_FIT_TCM_P1V8/BUCK_SYNC, sheet U_FIT_TCM_P3V3/BUCK_SYNC
EN_P1V0: sheet U_FIT_TCM_LOGIC/EN_P1V0, sheet U_FIT_TCM_P1V0/EN_P1V0
EN_P1V0LDO_P3V3: sheet U_FIT_TCM_LDO/EN_P1V0_LDO, sheet U_FIT_TCM_LOGIC/EN_P1V0LDO_P3V3, sheet U_FIT_TCM_P3V3/EN_P3V3
EN_P1V8: sheet U_FIT_TCM_LOGIC/EN_P1V8, sheet U_FIT_TCM_P1V8/EN_P1V8
EN_P2V5_P1V8LDO_P1V2LDO: sheet U_FIT_TCM_LDO/EN_P2V5_P1V8LDO_P1V2LDO, sheet U_FIT_TCM_LOGIC/EN_P2V5_P1V8LDO_P1V2LDO
EN_PSU: port EN_PSU, sheet U_FIT_TCM_LOGIC/EN_PSU
FPGA_DONE: port FPGA_DONE, sheet U_FIT_TCM_LOGIC/FPGA_DONE
IN_PWR_OK: port IN_PWR_OK, sheet U_FIT_TCM_LOGIC/IN_PWR_OK, sheet U_FIT_TCM_P3V3/IN_PWR_OK
OVERTEMPn: port OVERTEMPn, sheet U_FIT_TCM_LOGIC/OVERTEMPn
P1V0_PG: sheet U_FIT_TCM_LOGIC/P1V0_PG, sheet U_FIT_TCM_P1V0/P1V0_PG
P1V0LDO_P3V3_PG: sheet U_FIT_TCM_LDO/P1V0_LDO_PG, sheet U_FIT_TCM_LOGIC/P1V0LDO_P3V3_PG, sheet U_FIT_TCM_P3V3/P3V3_PG
P1V8_PG: sheet U_FIT_TCM_LOGIC/P1V8_PG, sheet U_FIT_TCM_P1V8/P1V8_PG
P2V5_P1V8LDO_P1V2LDO_PG: port P2V5_P1V8LDO_P1V2LDO_PG, sheet U_FIT_TCM_LDO/P2V5_P1V8LDO_P1V2LDO_PG, sheet U_FIT_TCM_LOGIC/P2V5_P1V8LDO_P1V2LDO_PG

### Notes on the sheet
- Project/Equipment
- Document
- Designer
- Drawn by
- Check.by
- Copyright WUT ISE 2024.
  This documentation describes Open Hardware and is licensed under the CERN OHL v.2. You may redistribute and modify this documentation under the terms of the CERN OHL v.2. (http://ohwr.org/CERNOHL). This documentation is distributed WITHOUT ANY EXPRESS OR IMPLIED WARRANTY, INCLUDING OF MERCHANTABILITY, SATISFACTORY QUALITY AND FITNESS FOR A PARTICULAR PURPOSE. Please see the CERN OHL v.2 for applicable conditions.
- Contact
- File
- Last Mod.
- Print Date
- Sheet
- Size
- A3
- of
- Rev